# EAGLE design OSO-MISC-20-012 Vitals Board (EAGLE 9.4.2)
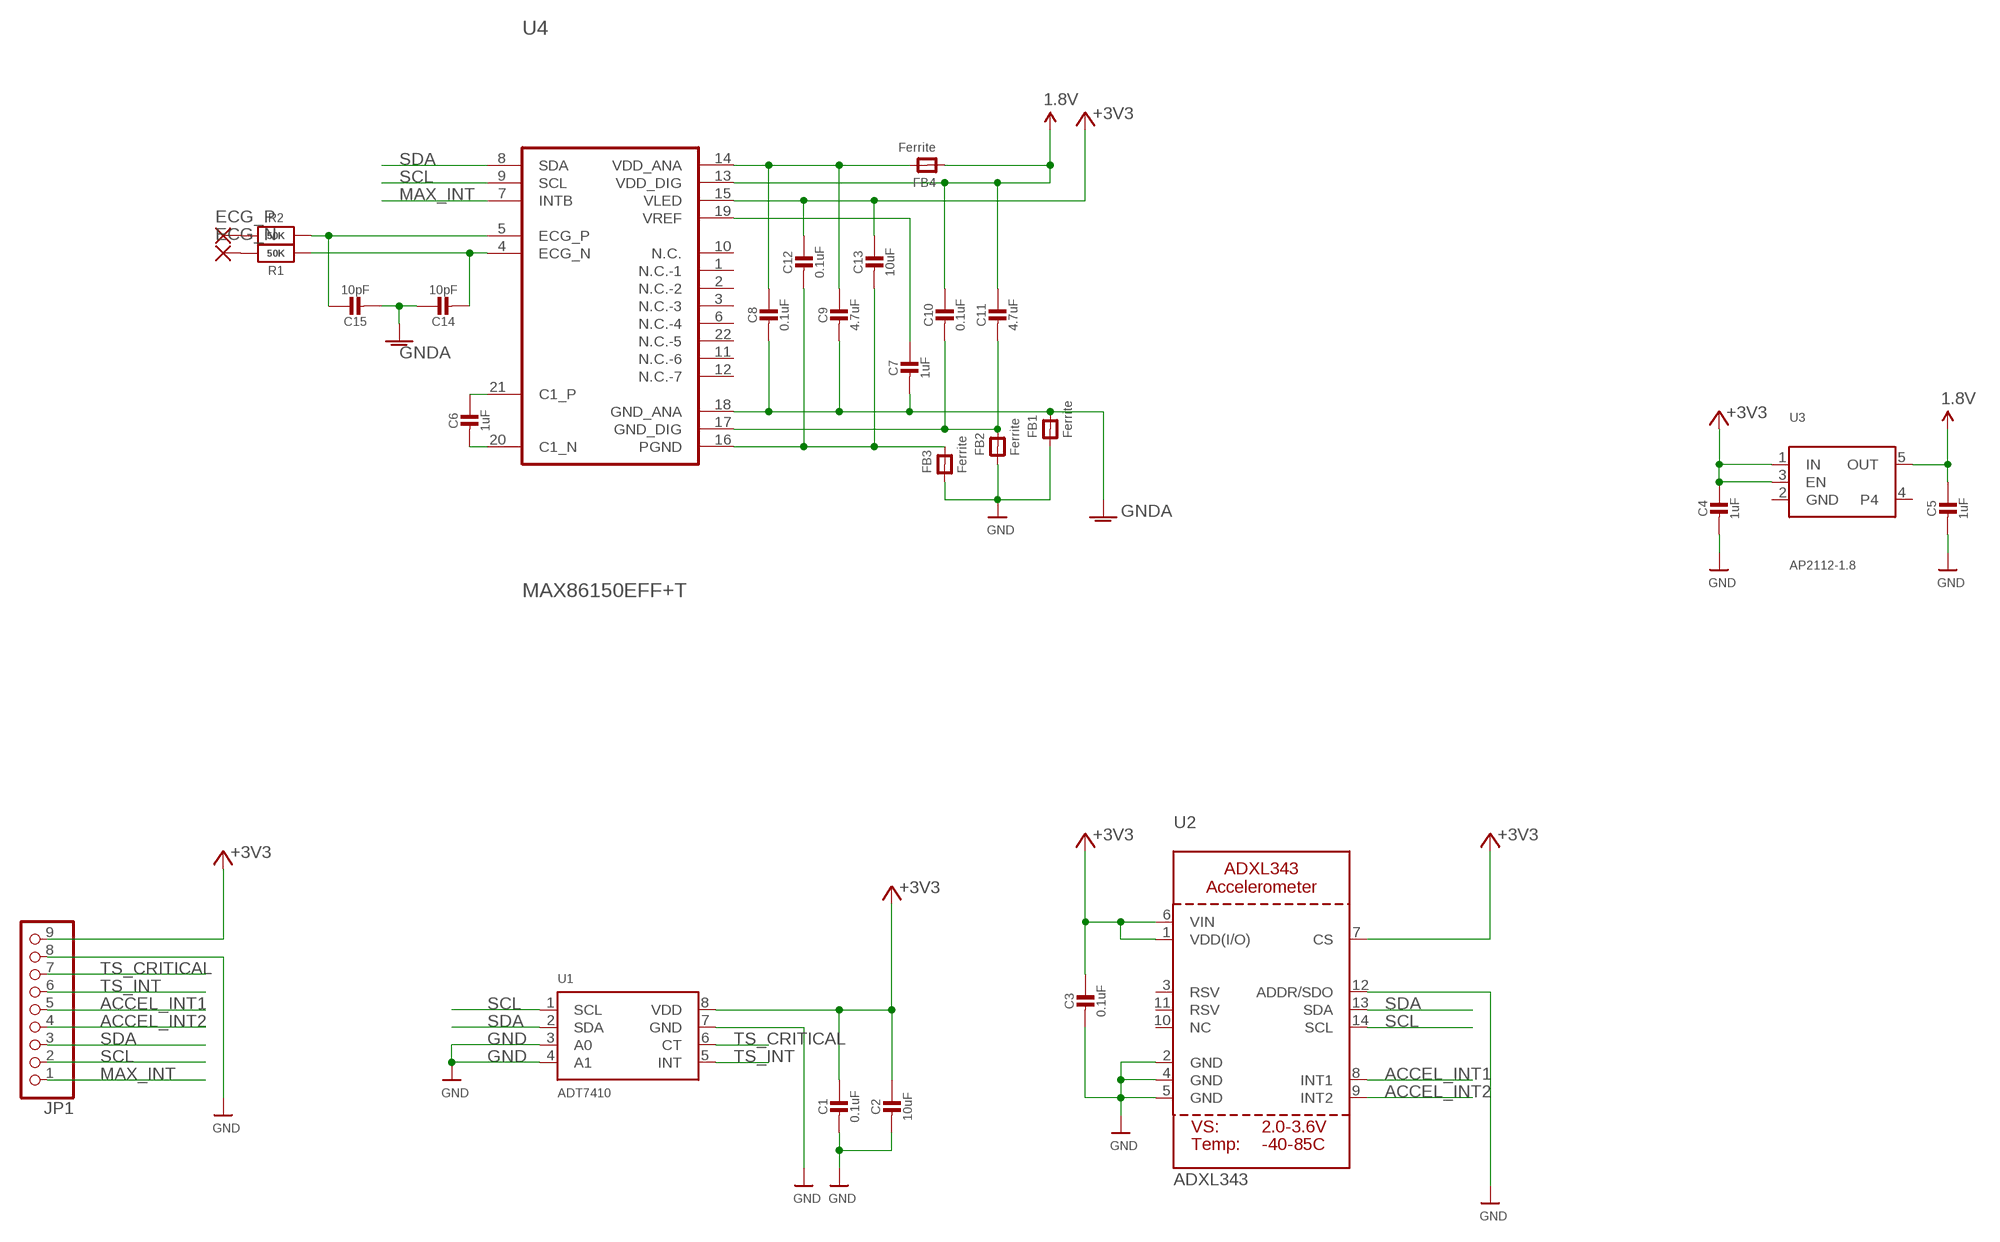
[diagram p0: schematic, sheet 1]

## Parts
C1  0.1uF  CAP_CERAMIC0603_NO  [0603-NO]
C2  10uF  CAP_CERAMIC0805-NOOUTLINE  [0805-NO]
C3  0.1uF  CAP_CERAMIC0603_NO  [0603-NO]
C4  1uF  CAP_CERAMIC0603_NO  [0603-NO]
C5  1uF  CAP_CERAMIC0603_NO  [0603-NO]
C6  1uF  CAP_CERAMIC0805-NOOUTLINE  [0805-NO]
C7  1uF  CAP_CERAMIC0603_NO  [0603-NO]
C8  0.1uF  CAP_CERAMIC0603_NO  [0603-NO]
C9  4.7uF  CAP_CERAMIC0805-NOOUTLINE  [0805-NO]
C10  0.1uF  CAP_CERAMIC0603_NO  [0603-NO]
C11  4.7uF  CAP_CERAMIC0805-NOOUTLINE  [0805-NO]
C12  0.1uF  CAP_CERAMIC0603_NO  [0603-NO]
C13  10uF  CAP_CERAMIC0805-NOOUTLINE  [0805-NO]
C14  10pF  CAP_CERAMIC0805-NOOUTLINE  [0805-NO]
C15  10pF  CAP_CERAMIC0805-NOOUTLINE  [0805-NO]
ECG_N  SMD5  [SMD2,54-5,08]
ECG_P  SMD5  [SMD2,54-5,08]
FB1  Ferrite  FERRITE_0805MP  [_0805MP]
FB2  Ferrite  FERRITE_0805MP  [_0805MP]
FB3  Ferrite  FERRITE_0805MP  [_0805MP]
FB4  Ferrite  FERRITE_0805MP  [_0805MP]
JP1  HEADER-1X9_JSTSH  [JST_SH9]
R1  50K  RESISTOR_0603_NOOUT  [0603-NO]
R2  50K  RESISTOR_0603_NOOUT  [0603-NO]
U1  ADT7410  TEMP_ADT7410  [SOIC8_150MIL]
U2  ADXL343  ACCEL_ADXL343  [LGA14]
U3  AP2112-1.8  VREG_SOT23-5  [SOT23-5]
U4  MAX86150EFF+T  [XDCR_MAX86150EFF+]

## Nets
1.8V: C5.1 C10.1 C11.1 FB4.1 U3.5(OUT) U4.13(VDD_DIG)
1V8_ANA: C8.1 C9.1 FB4.2 U4.14(VDD_ANA)
+3V3 [power]: C1.1 C2.1 C3.1 C4.1 C12.1 C13.1 JP1.9 U1.8(VDD) U2.1(VDD(I/O)) U2.6(VIN) U2.7(CS) U3.1(IN) U3.3(EN) U4.15(VLED)
ACCEL_INT1: JP1.5 U2.8(INT1)
ACCEL_INT2: JP1.4 U2.9(INT2)
GND [gnd]: C1.2 C2.2 C3.2 C4.2 C5.2 FB1.1 FB2.1 FB3.1 JP1.8 U1.3(A0) U1.4(A1) U1.7(GND) U2.2(GND) U2.4(GND) U2.5(GND) U2.12(ADDR/SDO)
GND_DIG: C10.2 C11.2 FB2.2 U4.17(GND_DIG)
GNDA: C7.2 C8.2 C9.2 C14.1 C15.2 FB1.2 U4.18(GND_ANA)
MAX_INT: JP1.1 U4.7(INTB)
N$1: ECG_P.1(P) R2.1
N$2: ECG_N.1(P) R1.1
N$4: C15.1 R2.2 U4.5(ECG_P)
N$5: C6.1 U4.21(C1_P)
N$6: C6.2 U4.20(C1_N)
N$9: C14.2 R1.2 U4.4(ECG_N)
PGND: C12.2 C13.2 FB3.2 U4.16(PGND)
SCL: JP1.2 U1.1(SCL) U2.14(SCL) U4.9(SCL)
SDA: JP1.3 U1.2(SDA) U2.13(SDA) U4.8(SDA)
TS_CRITICAL: JP1.7 U1.6(CT)
TS_INT: JP1.6 U1.5(INT)
VREF: C7.1 U4.19(VREF)
Unconnected: U2.3(RSV) U2.10(NC) U2.11(RSV) U3.4 U4.1(N.C.-1) U4.2(N.C.-2) U4.3(N.C.-3) U4.6(N.C.-4) U4.10(N.C.) U4.11(N.C.-6) U4.12(N.C.-7) U4.22(N.C.-5)

## Power pins joined to a net without a drawn wire
GND: U3.2(GND)

## Library data of the parts
C1-C15 = microbuilder:CAP_CERAMIC: Ceramic Capacitors For new designs, use the packages preceded by an '_' character since they are more reliable: The following footprints should be used on most boards: _0402 - Standard footprint for regular board layouts _0603 - Standard footprint for regular board layouts _0805 - Standard footprint for regular board layouts _1206 - Standard footprint for regular board layouts For extremely tight-pitch boards where space is at a premium, the following 'micro-pitch' footprints can be used (smaller pads, no silkscreen outline, etc.): _0402MP - Micro-pitch footprint for very dense/compact boards _0603MP - Micro-pitch footprint for very dense/compact boards _0805MP - Micro-pitch footprint for very dense/compact boards _1206MP - Micro-pitch footprint for very dense/compact boards
ECG_N ECG_P = wirepad:SMD5: SMD PAD
FB1-FB4 = microbuilder:FERRITE: Ferrite Bead 0603 MMZ1608B121C - 120 Ohm @ 100MHz, 600mA, 0.15 Ohm DC Resistance - Digikey: 445-2164-1-ND BK1608HW121-T - 120 Ohm, 600mA Ferrite Chip - Digikey: 587-1876-2-ND 0805 HZ0805B272R-10 - 2.7K Ohm @ 100MHz, 200mA, 0.8 Ohm DC Resistance - Digikey: 240-2504-1-ND (see also Murata BLM21BD272SN1L) MMZ2012Y152B - 1.5K Ohm @ 100MHz, 500mA, 0.4 Ohm DC Resistance - Digikey: 445-1560-1-ND - Mainly for high frequency (80-400MHz) MMZ2012R102A - 1K Ohm @ 100MHz, 500mA, 0.3 Ohm DC Resistance - Digikey: 445-1555-2-ND - More general purpose (10-200MHz)
JP1 = microbuilder:HEADER-1X9: PIN HEADER
R1 R2 = microbuilder:RESISTOR: Resistors For new designs, use the packages preceded by an '_' character since they are more reliable: The following footprints should be used on most boards: _0402 - Standard footprint for regular board layouts _0603 - Standard footprint for regular board layouts _0805 - Standard footprint for regular board layouts _1206 - Standard footprint for regular board layouts For extremely tight-pitch boards where space is at a premium, the following 'micro-pitch' footprints can be used (smaller pads, no silkscreen outline, etc.): _0402MP - Micro-pitch footprint for very dense/compact boards _0603MP - Micro-pitch footprint for very dense/compact boards _0805MP - Micro-pitch footprint for very dense/compact boards _1206MP - Micro-pitch footprint for very dense/compact boards
U1 = microbuilder:TEMP_ADT7410: ADT7410 - 13-bit 0.5°C I2C Temperature Sensor Operating Voltage: 2.7-5.5V Temperature Range: -55°C-150°C Accuracy: 0.5°C from -40°C-105°C Shutdown Current: 2uA (3.3V) Typical Operating Current (1 Sample/s): 46uA (3.3V) Digikey: ADT7410TRZ-ND
U2 = microbuilder:ACCEL_ADXL343: ADXL343 - Digital Accelerometer 2/4/8/16g
U3 = microbuilder:VREG_SOT23-5: SOT23-5 Fixed Voltage Regulators Part Current Out V Out V In V Dropout θJA (°C/W) TJ (°C) Digikey Part No. ADP121 150mA 3.3V 3.4-5.5V 0.09V @ 150mA -- -- ADP121-AUJZ33R7CT-ND ADP121 150mA 3.0V 3.1-5.5V 0.09V @ 150mA -- -- ADP121-AUJZ30R7CT-ND ADP122 300mA 3.3V 3.4-5.5V 0.085V @ 300mA -- -- ADP122AUJZ-3.3-R7CT-ND ADP1712 300mA 3.3V 3.5-5.5V 0.17V @ 300mA -- -- ADP1712AUJZ-3.3-R7TR-ND AP7311 (Low Cost) 150mA 3.3V 3.5-6V 0.15V @ 150mA -- -- AP7311-33WG-7DICT-ND LD39015M18R 150mA 1.8V 1.9V-5.5V 0.08V @ 100mA -- -- 497-6977-1-ND LP2985A-33DBVR 150mA 3.3V 3.3-16V 0.28V @ 150mA 206 150 296-18479-1-ND MCP1824T-3302E/OT 300mA 3.3V 3.5V-6V 0.2V @ 300mA -- -- MCP1824T-3302E/OTCT-ND MIC5205-2.5YM5 TR 150mA 2.5V 2.7-16V 0.165V @ 150mA -- -- 576-1257-2-ND MIC5205-3.0YM5 TR 150mA 3.0V 3.2V-16V 0.165V @ 150mA -- -- 576-1258-2-ND MIC5205-3.3YM5 TR 150mA 3.3V 3.5V-16V 0.165V @ 150mA -- -- 576-1259-2-ND TPS780330220 150mA 3.3V+2.2V 3.6-5.5V 250mV Max -- -- 296-23332-1-ND TDA3663/N1,135 100mA 3.3V 3.5-45V 0.18V @ 50mA -- -- 568-5343-1-ND Max operating temp can be calculated using θJA, TJ (max junction temperature), and power in watts. Set the "Maximum Ambient Temperature" until it reaches TJ ("Max Junction Temperature"), which is the absolute limit for safe use of the regulator: Heat Sink Temperature Calculator <http://www.daycounter.com/Calculators/Heat-Sink-Temperature-Calculator.phtml> For example, With 12V source into a 3.3V LP2985 and a 30mA load, we are dissipating (12V-3.3V) * 0.03A = 0.261W. With a θJA of 206 °C/W, a TJ of 150°C, and 261mW we can safely use the chip without a heat sink up to 75°C (=147.1°C Junction Temperature).
U4 = MAX86150EFF_T:MAX86150EFF+T; DESCRIPTION: Oximeter/Heart Rate Sensor I²C Output; DIGI-KEY_PART_NUMBER: MAX86150EFF+TCT-ND; MF: Maxim Integrated; MP: MAX86150EFF+T; PACKAGE: OLGA-22 Maxim

## Net classes
0 default: width 0.152 mm, drill 0.254 mm
1 power: width 0.305 mm, drill 0.305 mm
2 gnd: width 0.254 mm, drill 0.254 mm

## Board
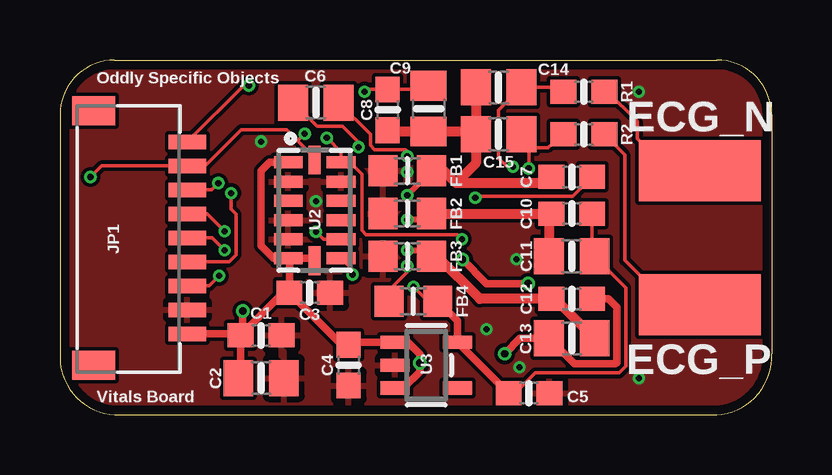
[diagram p1: board, top side]
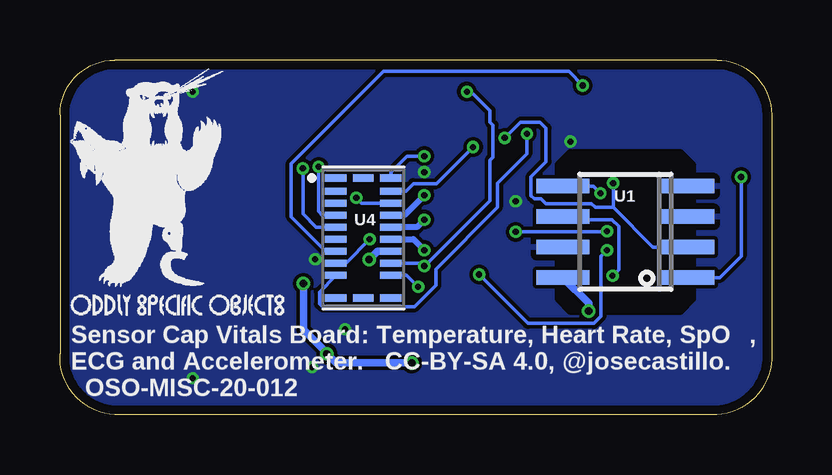
[diagram p2: board, bottom side, seen from below]

Size 29.67 x 14.78 mm. Coordinates in mm from the lower left corner, seen from the top.
Outline: 29.67,12.49 arc90 27.38,14.78 2.29,14.78 arc90 0,12.49 0,2.54 arc90 2.29,0 27.38,0 arc90 29.67,2.54 29.67,12.49
Copper layers (1*16): Top 0.035559375mm / dielectric 1.6mm / Bottom 0.035559375mm
Design rules "oshpark-2layer *": minimum track width 6mil, minimum drill 10mil, track to track 6mil, track to pad 6mil, pad to pad 6mil, via to via 6mil, smd to smd 6mil, copper to edge 15mil, drill to drill 6mil, minimum pad ring 5mil, minimum via ring 5mil, stop-mask expansion 2.5mil, vias tented up to drill 12mil, thermal gap 10mil

### Footprints (pad centres in the part's own frame; a part is rotated, then mirrored left to right if it is on the bottom)
0603-NO = smd 1.075 x 1: 1 -0.85,0; 2 0.85,0
0805-NO = smd 1.24 x 1.5: 1 -0.95,0; 2 0.95,0
SMD2,54-5,08 = smd 2.54 x 5.08: 1 0,0
_0805MP = smd 1.2 x 1.3: 1 -1.016,0; 2 1.016,0
JST_SH9 = smd 0.6 x 1.55: 1 -4,2.514; 2 -3,2.514; 3 -2,2.514; 4 -1,2.514; 5 0,2.514; 6 1,2.514; 7 2,2.514; 8 3,2.514; 9 4,2.514 | smd 1.2 x 1.8: MT1 -5.3,-1.386; MT2 5.3,-1.386
SOIC8_150MIL = smd 0.6 x 2.2: 1 -1.905,-2.6; 2 -0.635,-2.6; 3 0.635,-2.6; 4 1.905,-2.6; 5 1.905,2.6; 6 0.635,2.6; 7 -0.635,2.6; 8 -1.905,2.6
LGA14 = smd 0.5 x 1.2: 1 2,1.1; 2 1.2,1.1; 3 0.4,1.1; 4 -0.4,1.1; 5 -1.2,1.1; 6 -2,1.1; 8 -2,-1.1; 9 -1.2,-1.1; 10 -0.4,-1.1; 11 0.4,-1.1; 12 1.2,-1.1; 13 2,-1.1 | smd 1.2 x 0.5: 7 -2.1,0; 14 2.1,0
SOT23-5 = smd 0.55 x 1.2: 1 -0.95,-1.3; 2 0,-1.3; 3 0.95,-1.3; 4 0.95,1.3; 5 -0.95,1.3
XDCR_MAX86150EFF+ = smd 0.9 x 0.3: 1 -1.15,2.5; 2 -1.15,1.95; 3 -1.15,1.45; 4 -1.15,0.95; 5 -1.15,0.45; 6 -1.15,-0.05; 7 -1.15,-0.55; 8 -1.15,-1.05; 9 -1.15,-1.55; 10 -1.15,-2.5; 12 1.15,-2.5; 13 1.15,-1.55; 14 1.15,-1.05; 15 1.15,-0.55; 16 1.15,-0.05; 17 1.15,0.45; 18 1.15,0.95; 19 1.15,1.45; 20 1.15,1.95; 21 1.15,2.5 | smd 0.85 x 0.3: 11 0,-2.5; 22 0,2.5

### Placement (x,y rotation side)
C1  8.38,3.3 0 top
C2  8.38,1.52 0 top
C3  10.42,5.08 0 top
C4  12.03,2.06 270 top
C5  19.56,0.89 0 top
C6  10.67,13 180 top
C7  21.34,9.91 180 top
C8  13.67,12.7 270 top
C9  15.37,12.75 270 top
C10  21.34,8.38 180 top
C11  21.34,6.6 180 top
C12  21.34,4.83 180 top
C13  21.34,3.17 0 top
C14  18.29,13.64 0 top
C15  18.29,11.68 180 top
ECG_N  26.67,10.16 270 top
ECG_P  26.67,4.57 90 top
FB1  14.48,10.16 0 top
FB2  14.48,8.38 0 top
FB3  14.48,6.6 0 top
FB4  14.73,4.72 180 top
JP1  2.8,7.37 270 top
R1  21.85,13.46 180 top
R2  21.85,11.68 180 top
U1  6.1,7.62 90 bottom
U2  10.62,8.51 90 top
U3  15.27,2.06 270 top
U4  17.02,7.37 0 bottom
U$3  [OSO_BEAR_250X360MIL_1000DPI]  26.04,9.91 0 bottom
U$7  [OSO_WORDMARK_ONELINE_350MIL_1000DPI]  24.77,4.57 0 bottom

### Tracks (layer width: path | path; a pad name or v marks a point on that pad's centre or on a via)
1.8V  (via drill 0.25)
  Top 0.152: v14.73,5.33 15.34,4.72 FB4.1 | C10.1 22.19,6.7 C11.1 23.59,5.3 23.59,2.01 23.32,1.74 19.81,1.74 18.96,0.89 C5.1
  Top 0.305: FB4.1 16.57,3.9 U3.5 18.69,0.89 C5.1
  Bottom 0.152: U4.13 15.22,5.82 v14.73,5.33
1V8_ANA  (via drill 0.25)
  Top 0.152: FB4.2 13.72,5.18 14.47,5.93 14.47,6.19 v14.48,6.2 | C9.1 15.22,13.55 C8.1 12.79,13.55 v12.7,13.46
  Bottom 0.152: U4.14 14.6,6.32 v14.48,6.2 14.46,6.2 11.74,8.92 11.74,10.61 11.61,10.74 11.61,12.06 11.74,12.19 11.74,12.67 12.53,13.46 v12.7,13.46
+3V3  (via drill 0.3)
  Top 0.305: JP1.9 7.47,3.37 C1.1 | C2.1 7.53,1.62 C1.1 | C1.1 9.31,5.08 C3.1 | C3.1 9.57,6.46 U2.6 | U2.6 10.52,6.51 U2.7 | v7.62,4.32 7.62,3.39 C1.1 | C3.1 11.73,2.91 C4.1 12.13,3.01 U3.1 14.51,3.01 15,2.53 v15,2.16 15,1.79 14.33,1.11 U3.3 | v18.54,2.54 19.18,3.17 C13.1 21.44,2.12 23.16,2.12 23.21,2.17 23.21,4.47 22.86,4.83 C12.1 | U2.1 8.73,10.51 8.38,10.16 8.38,7.04 8.91,6.51 U2.6 | v16.78,6.47 17.79,5.46 v19.52,5.46
  Bottom 0.305: U1.8 7.62,4.64 v7.62,4.32 | v15,2.16 18.16,2.16 v18.54,2.54 18.54,2.56 19.52,3.53 v19.52,5.46 | U4.15 16.44,6.82 v16.78,6.47
ACCEL_INT1  (via drill 0.25)
  Top 0.152: U2.8 12.19,6.03 v12.19,5.84 | v6.86,6.86 6.35,7.37 JP1.5
  Bottom 0.152: v12.19,5.84 10.16,3.81 7.41,3.81 7.11,4.11 7.11,6.6 v6.86,6.86
ACCEL_INT2  (via drill 0.25)
  Top 0.152: U2.9 10.98,7.31 v10.67,7.62 | v6.86,7.64 6.14,8.37 JP1.4
  Bottom 0.152: v10.67,7.62 6.88,7.62 v6.86,7.64
GND  (via drill 0.25)
  other vias: 17.78,3.56 19.15,1.98 24.13,1.52 10.67,8.89 14.48,10.11 8.38,11.38 19.03,6.48 24.13,13.46
  pour Bottom: 30.99,14.73 0,14.73 0,0 30.99,0
  pour Top: 29.67,14.78 0,14.78 0,0 29.67,0
  cutout Bottom: 8.38,10.92 3.81,10.92 3.3,10.41 3.3,4.83 3.81,4.32 8.38,4.32 8.89,4.83 8.89,10.41
GND_DIG  (via drill 0.25)
  Top 0.254: FB2.2 15.24,8.13 v14.48,8.13
  Top 0.406: FB2.2 C10.2 20.39,8.28 C11.2
  Bottom 0.254: v14.48,8.13 14.79,7.82 U4.17
GNDA  (via drill 0.25)
  Top 0.254: FB1.2 v14.48,9.14
  Top 0.406: FB1.2 16,10.16 16.51,9.65 | C7.2 20.23,9.65 16.51,9.65 | C15.2 17.34,10.48 16.51,9.65 | C15.2 17.22,11.8 C9.2 13.72,11.8 C8.2 | C14.1 C15.2
  Bottom 0.254: U4.18 15.31,8.32 v14.48,9.14
MAX_INT  (via drill 0.25)
  Top 0.152: v7.88,13.72 7.66,13.72 JP1.1
  Bottom 0.152: U4.7 18.59,6.82 20.03,8.25 20.03,10.46 16.19,14.3 8.46,14.3 v7.88,13.72
N$1
  Top 0.152: ECG_P.1 25.4,4.57 23.55,6.43 23.55,10.83 R2.1
N$2
  Top 0.152: ECG_N.1 25.4,10.16 24.07,11.5 24.07,12.22 22.82,13.46 R1.1
N$4  (via drill 0.25)
  Top 0.152: v19.54,10.26 19.54,11.13 19.8,11.13 | 19.8,11.13 C15.1 | R2.2 20.34,11.13 19.8,11.13
  Bottom 0.152: U4.5 18.99,7.82 19.54,8.37 v19.54,10.26
N$5  (via drill 0.25)
  Top 0.152: C6.1 12.94,11.69 12.94,11.22 13.12,11.04 14.41,11.04 14.48,10.97 v14.48,10.77
  Bottom 0.152: U4.21 15.87,10.1 15.19,10.77 v14.48,10.77
N$6  (via drill 0.25)
  Top 0.152: v12.45,11.15 12.45,11.35 11.78,12.01 10.71,12.01 C6.2
  Bottom 0.152: U4.20 15.24,9.32 14.93,9.63 13.97,9.63 v12.45,11.15
N$9  (via drill 0.25)
  Top 0.152: v18.88,10.33 18.65,10.33 18.29,10.69 18.29,12.69 C14.2 20.82,13.64 R1.2
  Bottom 0.152: v18.88,10.33 18.88,8.47 18.73,8.32 U4.4
PGND  (via drill 0.25)
  Top 0.254: v14.48,6.86 15.24,6.86 FB3.2
  Top 0.406: FB3.2 15.72,6.6 17.5,4.83 C12.2 20.64,4.83 C13.2
  Bottom 0.254: U4.16 14.94,7.32 v14.48,6.86
SCL  (via drill 0.25)
  Top 0.152: U2.14 10.62,10.71 9.9,11.43 | 9.9,11.43 9.45,11.88 7.56,11.88 6.05,10.37 JP1.2 1.73,10.37 v1.27,9.91 | 9.9,11.43 10.19,11.71 v10.21,11.71
  Bottom 0.152: v1.27,9.91 1.27,6.6 2.16,5.71 U1.1 | U4.9 18.17,5.79 18.85,5.11 18.85,4.62 18.71,4.49 14.9,4.49 14,5.39 14,6.07 11.43,8.64 11.43,9.65 10.21,10.88 v10.21,11.71
SDA  (via drill 0.25)
  Top 0.152: v6.61,9.65 6.32,9.37 JP1.3 | U2.13 11.72,10.67 | v11.13,11.53 11.72,10.94 11.72,10.67 | v16.76,7.32 16.57,7.5 12.77,7.5 12.58,7.69 12.58,10.02 11.94,10.67 11.72,10.67
  Bottom 0.152: U1.2 4.95,6.99 6.61,8.64 | 6.61,8.64 v6.61,9.65 | 6.61,8.64 7.36,8.64 7.5,8.78 9.4,8.78 9.61,9 9.89,9 10.03,9.13 10.03,9.92 9.4,10.55 9.4,11.94 9.65,12.19 10.47,12.19 v11.13,11.53 | U4.8 17.75,6.31 16.76,7.31 v16.76,7.32
TS_CRITICAL  (via drill 0.25)
  Top 0.152: v6.63,5.78 6.21,5.37 JP1.7
  Bottom 0.152: U1.6 8.57,8.13 6.66,8.13 6.38,7.84 6.38,6.04 v6.63,5.78
TS_INT  (via drill 0.25)
  Top 0.152: v7.14,9.23 7.14,8.56 7.34,8.35 7.34,6.66 7.06,6.38 JP1.6
  Bottom 0.152: v7.14,9.23 7.43,9.53 U1.5
VREF  (via drill 0.25)
  Top 0.152: C7.1 21.39,9.11 17.38,9.11 v17.31,9.04
  Bottom 0.152: v17.31,9.04 17.09,8.82 U4.19

### Text on the board
tPlace: Oddly Specific Objects | Vitals Board
bPlace: Sensor Cap Vitals Board: Temperature, Heart Rate, SpO₂, / ECG and Accelerometer. CC-BY-SA 4.0, @josecastillo. / OSO-MISC-20-012